# Altium schematic sheet GPS.SchDoc
size A4; SheetNumber: 9; SheetTotal: 11
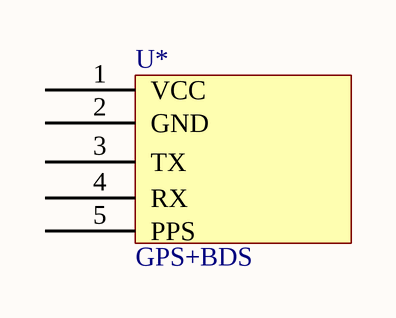
[diagram p0: GPS.SchDoc]

## Parts
U*  GPS+BDS

## Nets

Not connected (* = marked no-connect by the designer): U* 1(VCC) 2(GND) 3(TX) 4(RX) 5(PPS)